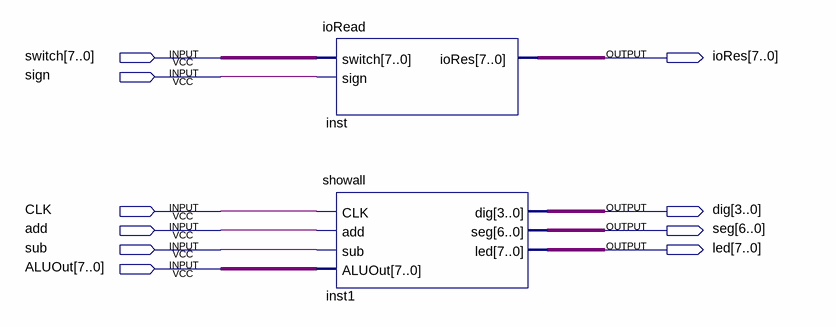
[diagram p0: schematic sheet]
// Quartus schematic IO.bdf as structural Verilog: 2 symbols, 10 pins
module IO (
  input  [7:0] switch,
  input  sign,
  input  CLK,
  input  add,
  input  sub,
  input  [7:0] ALUOut,
  output [7:0] ioRes,
  output [3:0] dig,
  output [6:0] seg,
  output [7:0] led
);

  ioRead inst (.switch(switch), .sign(sign), .ioRes(ioRes));
  showall inst1 (.CLK(CLK), .add(add), .sub(sub), .ALUOut(ALUOut), .dig(dig), .seg(seg), .led(led));
endmodule
